# EAGLE design clock (EAGLE 5.11)
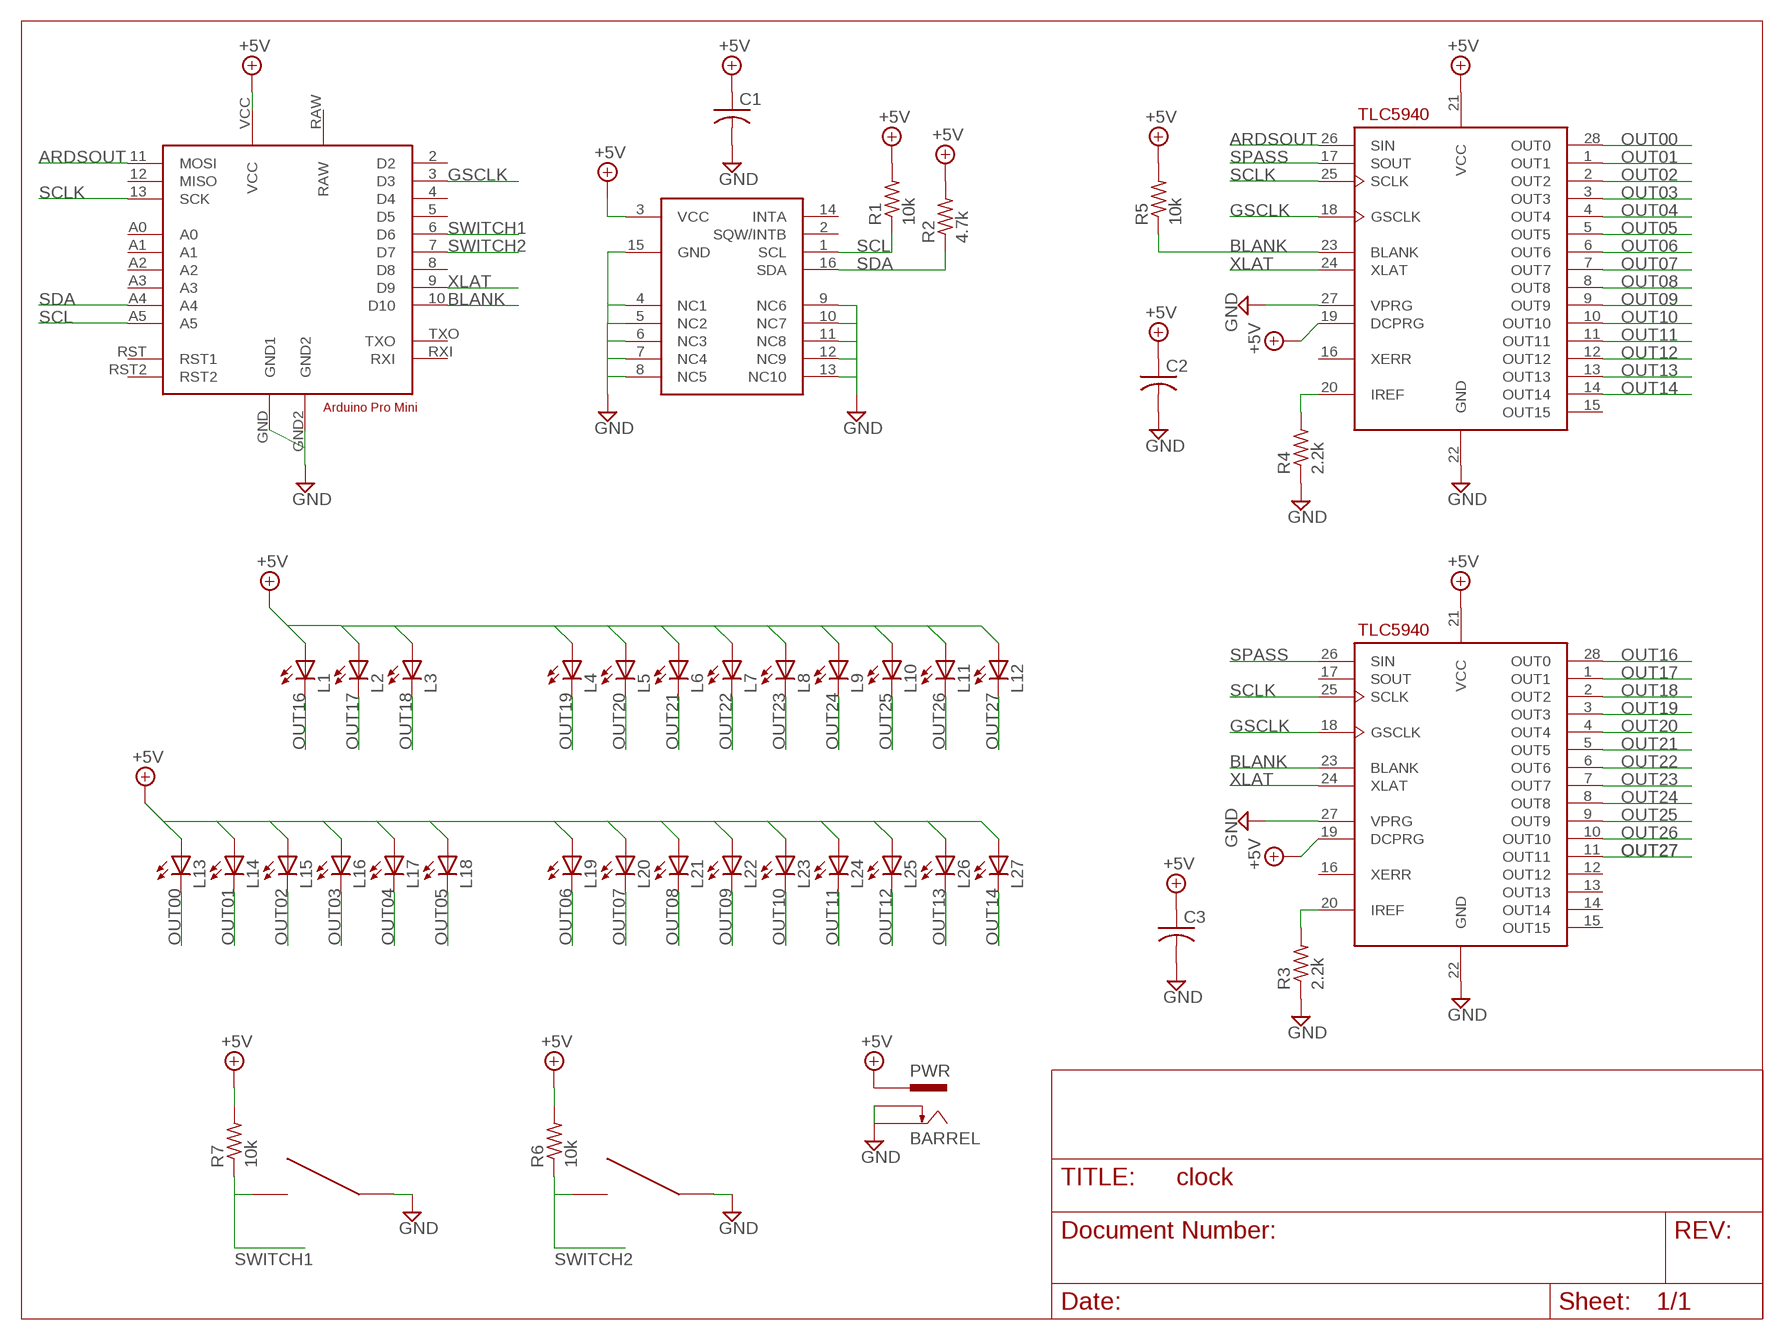
[diagram p0: schematic, sheet 1]

## Parts
C1  C-US025-024X044  [C025-024X044]
C2  C-US025-024X044  [C025-024X044]
C3  C-US025-024X044  [C025-024X044]
L1  LEDKA-3528ASYC  [KA-3528ASYC]
L2  LEDKA-3528ASYC  [KA-3528ASYC]
L3  LEDKA-3528ASYC  [KA-3528ASYC]
L4  LEDKA-3528ASYC  [KA-3528ASYC]
L5  LEDKA-3528ASYC  [KA-3528ASYC]
L6  LEDKA-3528ASYC  [KA-3528ASYC]
L7  LEDKA-3528ASYC  [KA-3528ASYC]
L8  LEDKA-3528ASYC  [KA-3528ASYC]
L9  LEDKA-3528ASYC  [KA-3528ASYC]
L10  LEDKA-3528ASYC  [KA-3528ASYC]
L11  LEDKA-3528ASYC  [KA-3528ASYC]
L12  LEDKA-3528ASYC  [KA-3528ASYC]
L13  LEDKA-3528ASYC  [KA-3528ASYC]
L14  LEDKA-3528ASYC  [KA-3528ASYC]
L15  LEDKA-3528ASYC  [KA-3528ASYC]
L16  LEDKA-3528ASYC  [KA-3528ASYC]
L17  LEDKA-3528ASYC  [KA-3528ASYC]
L18  LEDKA-3528ASYC  [KA-3528ASYC]
L19  LEDKA-3528ASYC  [KA-3528ASYC]
L20  LEDKA-3528ASYC  [KA-3528ASYC]
L21  LEDKA-3528ASYC  [KA-3528ASYC]
L22  LEDKA-3528ASYC  [KA-3528ASYC]
L23  LEDKA-3528ASYC  [KA-3528ASYC]
L24  LEDKA-3528ASYC  [KA-3528ASYC]
L25  LEDKA-3528ASYC  [KA-3528ASYC]
L26  LEDKA-3528ASYC  [KA-3528ASYC]
L27  LEDKA-3528ASYC  [KA-3528ASYC]
PWR  BARREL  [BARREL]
R1  10k  R-US_R1206  [R1206]
R2  4.7k  R-US_R1206  [R1206]
R3  2.2k  R-US_R1206  [R1206]
R4  2.2k  R-US_R1206  [R1206]
R5  10k  R-US_R1206  [R1206]
R6  10k  R-US_R1206  [R1206]
R7  10k  R-US_R1206  [R1206]
SW1  SPST-MICRO  [MICROSWITCH]
SW2  SPST-MICRO  [MICROSWITCH]
U1  TLC5940NT  [DIL28-4]
U2  TLC5940NT  [DIL28-4]
U3  DS1337C  [SO-16DW]
U$4  ARDUINO_MINI_PRO  [ARD_MINI_PRO]

## Nets
+5V: C1.1 C2.1 C3.1 L1.A L2.A L3.A L4.A L5.A L6.A L7.A L8.A L9.A L10.A L11.A L12.A L13.A L14.A L15.A L16.A L17.A L18.A L19.A L20.A L21.A L22.A L23.A L24.A L25.A L26.A L27.A PWR.1 R1.2 R2.2 R5.2 R6.2 R7.2 U1.19(DCPRG) U1.21(VCC) U2.19(DCPRG) U2.21(VCC) U3.3(VCC) U$4.VCC
ARDSOUT: U2.26(SIN) U$4.11(MOSI)
BLANK: R5.1 U1.23(BLANK) U2.23(BLANK) U$4.10(D10)
GND: C1.2 C2.2 C3.2 PWR.2 PWR.3 R3.1 R4.1 SW1.PIN2 SW2.PIN2 U1.22(GND) U1.27(VPRG) U2.22(GND) U2.27(VPRG) U3.4(NC1) U3.5(NC2) U3.6(NC3) U3.7(NC4) U3.8(NC5) U3.9(NC6) U3.10(NC7) U3.11(NC8) U3.12(NC9) U3.13(NC10) U3.15(GND) U$4.GND2 U$4.GND(GND1)
GSCLK: U1.18(GSCLK) U2.18(GSCLK) U$4.3(D3)
N$3: R3.2 U1.20(IREF)
N$4: R4.2 U2.20(IREF)
OUT00: L13.C U2.28(OUT0)
OUT01: L14.C U2.1(OUT1)
OUT02: L15.C U2.2(OUT2)
OUT03: L16.C U2.3(OUT3)
OUT04: L17.C U2.4(OUT4)
OUT05: L18.C U2.5(OUT5)
OUT06: L19.C U2.6(OUT6)
OUT07: L20.C U2.7(OUT7)
OUT08: L21.C U2.8(OUT8)
OUT09: L22.C U2.9(OUT9)
OUT10: L23.C U2.10(OUT10)
OUT11: L24.C U2.11(OUT11)
OUT12: L25.C U2.12(OUT12)
OUT13: L26.C U2.13(OUT13)
OUT14: L27.C U2.14(OUT14)
OUT16: L1.C U1.28(OUT0)
OUT17: L2.C U1.1(OUT1)
OUT18: L3.C U1.2(OUT2)
OUT19: L4.C U1.3(OUT3)
OUT20: L5.C U1.4(OUT4)
OUT21: L6.C U1.5(OUT5)
OUT22: L7.C U1.6(OUT6)
OUT23: L8.C U1.7(OUT7)
OUT24: L9.C U1.8(OUT8)
OUT25: L10.C U1.9(OUT9)
OUT26: L11.C U1.10(OUT10)
OUT27: L12.C U1.11(OUT11)
SCL: R1.1 U3.1(SCL) U$4.A5
SCLK: U1.25(SCLK) U2.25(SCLK) U$4.13(SCK)
SDA: R2.1 U3.16(SDA) U$4.A4
SPASS: U1.26(SIN) U2.17(SOUT)
SWITCH1: R7.1 SW1.PIN1 U$4.6(D6)
SWITCH2: R6.1 SW2.PIN1 U$4.7(D7)
XLAT: U1.24(XLAT) U2.24(XLAT) U$4.9(D9)
Unconnected: U1.12(OUT12) U1.13(OUT13) U1.14(OUT14) U1.15(OUT15) U1.16(XERR) U1.17(SOUT) U2.15(OUT15) U2.16(XERR) U3.2(SQW/INTB) U3.14(INTA) U$4.2(D2) U$4.4(D4) U$4.5(D5) U$4.8(D8) U$4.12(MISO) U$4.A0 U$4.A1 U$4.A2 U$4.A3 U$4.RAW U$4.RST2 U$4.RST(RST1) U$4.RXI U$4.TXO

## Library data of the parts
C1-C3 = rcl:C-US: CAPACITOR, American symbol
L1-L27 = led:LED: LED OSRAM: - CHIPLED LG R971, LG N971, LY N971, LG Q971, LY Q971, LO R971, LY R971 LH N974, LH R974 LS Q976, LO Q976, LY Q976 LO Q996 - Hyper CHIPLED LW Q18S LB Q993, LB Q99A, LB R99A - SideLED LS A670, LO A670, LY A670, LG A670, LP A670 LB A673, LV A673, LT A673, LW A673 LH A674 LY A675 LS A676, LA A676, LO A676, LY A676, LW A676 LS A679, LY A679, LG A679 - Hyper Micro SIDELED® LS Y876, LA Y876, LO Y876, LY Y876 LT Y87S - SmartLED LW L88C, LW L88S LB L89C, LB L89S, LG L890 LS L89K, LO L89K, LY L89K LS L896, LA L896, LO L896, LY L896 - TOPLED LS T670, LO T670, LY T670, LG T670, LP T670 LSG T670, LSP T670, LSY T670, LOP T670, LYG T670 LG T671, LOG T671, LSG T671 LB T673, LV T673, LT T673, LW T673 LH T674 LS T676, LA T676, LO T676, LY T676, LB T676, LH T676, LSB T676, LW T676 LB T67C, LV T67C, LT T67C, LS T67K, LO T67K, LY T67K, LW E67C LS E67B, LA E67B, LO E67B, LY E67B, LB E67C, LV E67C, LT E67C LW T67C LS T679, LY T679, LG T679 LS T770, LO T770, LY T770, LG T770, LP T770 LB T773, LV T773, LT T773, LW T773 LH T774 LS E675, LA E675, LY E675, LS T675 LS T776, LA T776, LO T776, LY T776, LB T776 LHGB T686 LT T68C, LB T68C - Hyper Mini TOPLED® LB M676 - Mini TOPLED Santana® LG M470 LS M47K, LO M47K, LY M47K Source: http://www.osram.convergy.de LUXEON: - LUMILED® LXK2-PW12-R00, LXK2-PW12-S00, LXK2-PW14-U00, LXK2-PW14-V00 LXK2-PM12-R00, LXK2-PM12-S00, LXK2-PM14-U00 LXK2-PE12-Q00, LXK2-PE12-R00, LXK2-PE12-S00, LXK2-PE14-T00, LXK2-PE14-U00 LXK2-PB12-K00, LXK2-PB12-L00, LXK2-PB12-M00, LXK2-PB14-N00, LXK2-PB14-P00, LXK2-PB14-Q00 LXK2-PR12-L00, LXK2-PR12-M00, LXK2-PR14-Q00, LXK2-PR14-R00 LXK2-PD12-Q00, LXK2-PD12-R00, LXK2-PD12-S00 LXK2-PH12-R00, LXK2-PH12-S00 LXK2-PL12-P00, LXK2-PL12-Q00, LXK2-PL12-R00 Source: www.luxeon.com KINGBRIGHT: KA-3528ASYC Source: www.kingbright.com
PWR = clock:BARREL
R1-R7 = resistor:R-US_: RESISTOR, American symbol
SW1 SW2 = clock:SPST-MICRO
U1 U2 = untitled:TLC5940
U3 = untitled:DS1337
U$4 = untitled:ARDUINO_MINI_PRO

## Board
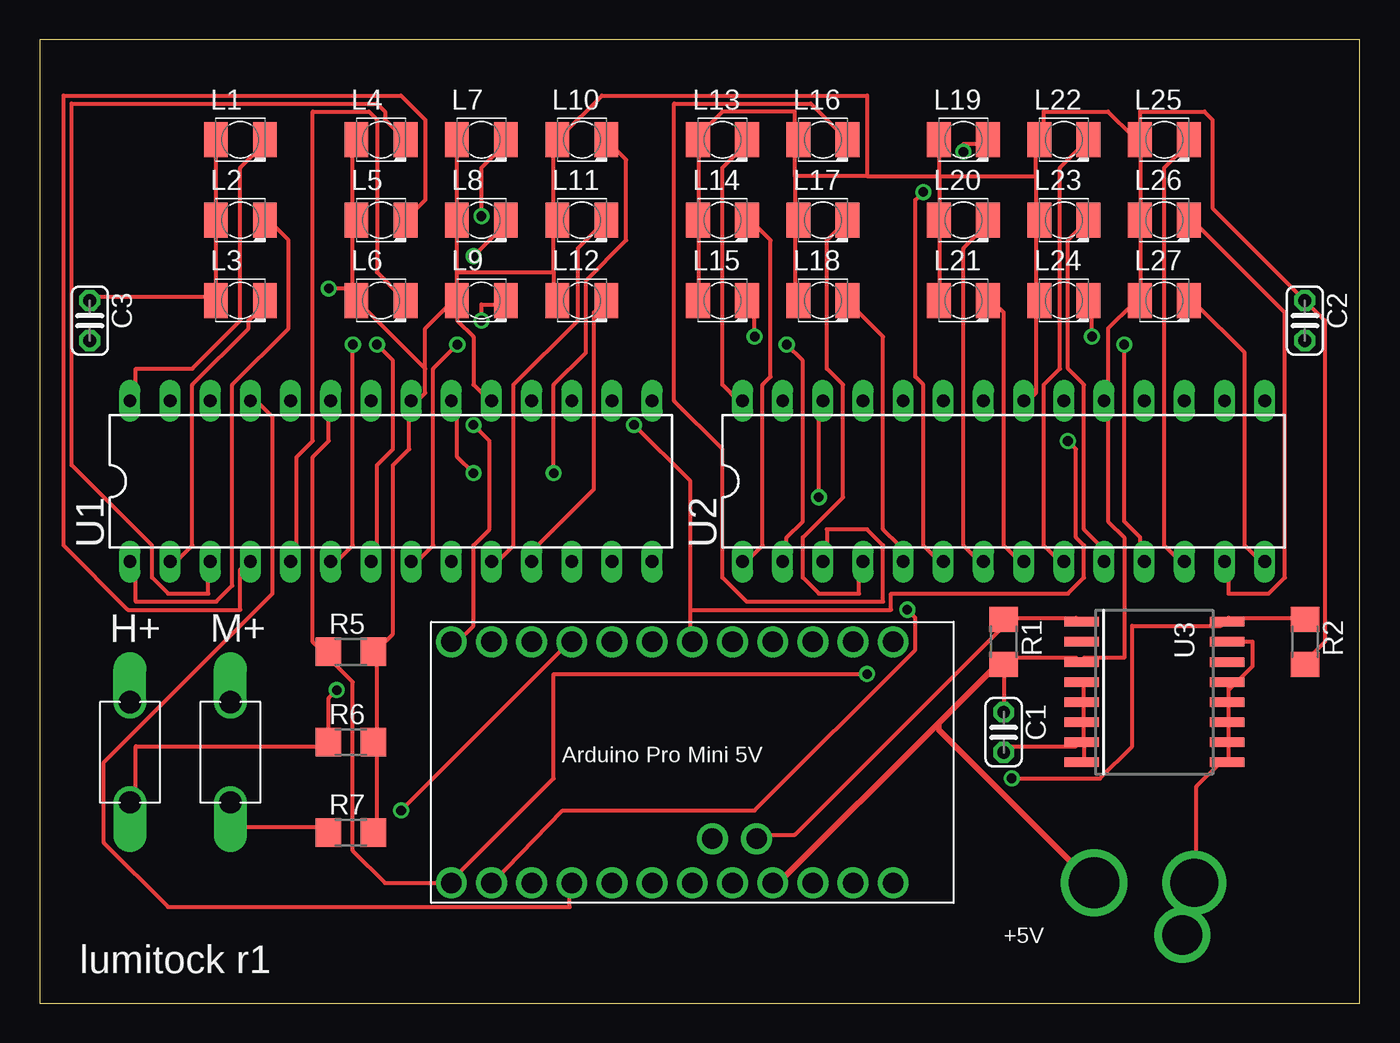
[diagram p1: board, top side]
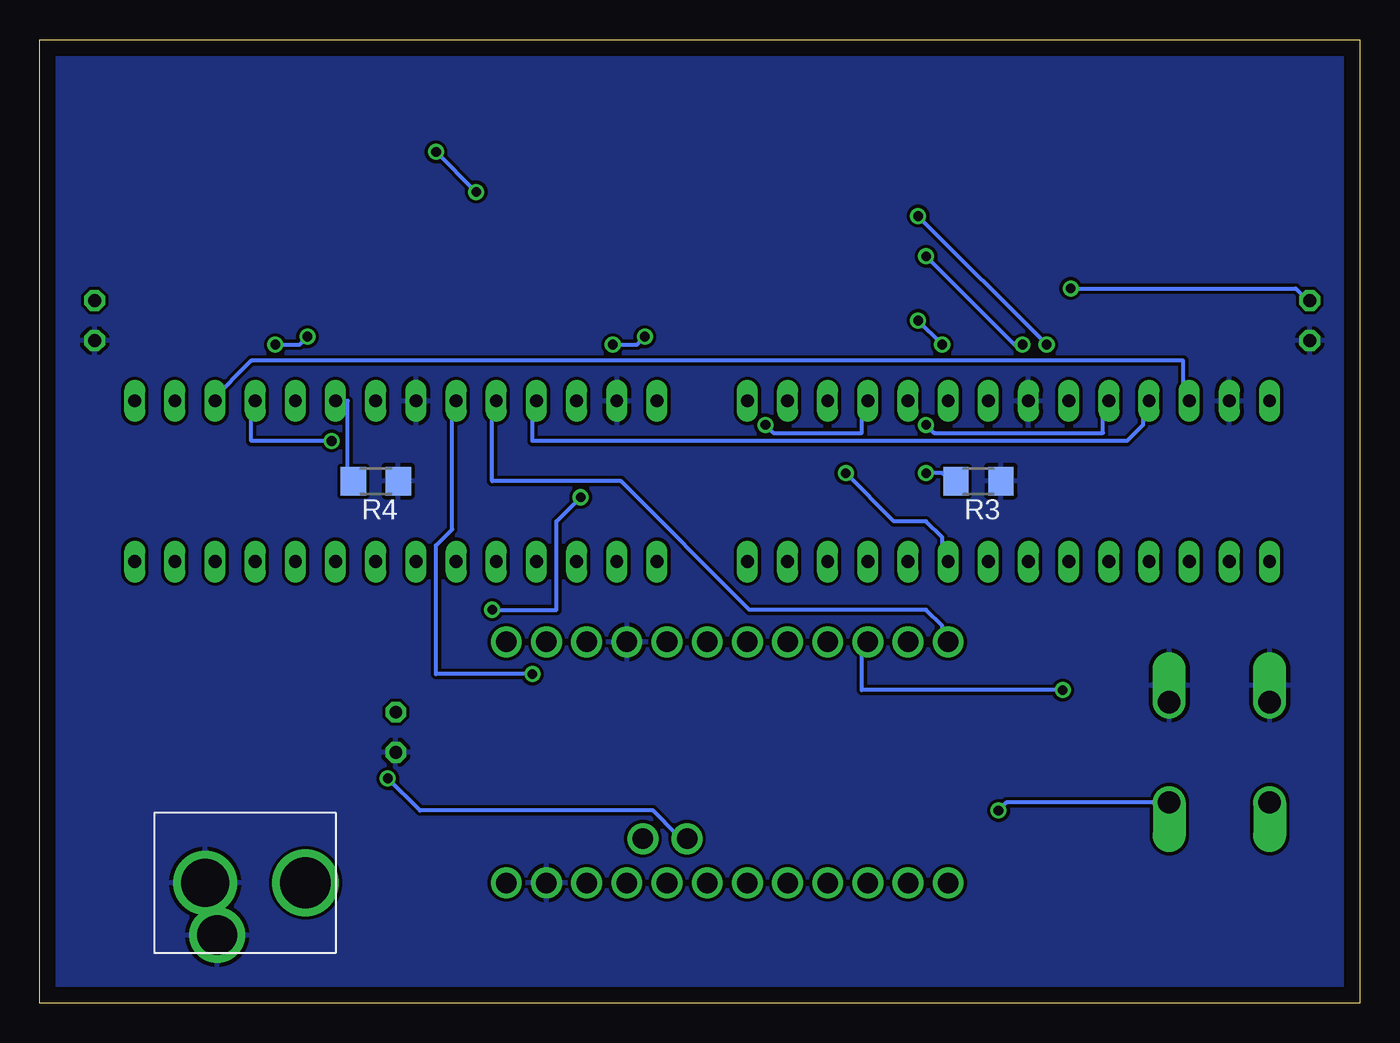
[diagram p2: board, bottom side, seen from below]

Size 83.49 x 60.95 mm. Coordinates in mm from the lower left corner, seen from the top.
Outline: 0,0 83.49,0 83.49,60.95 0,60.95 0,0
Copper layers (1*16): Top 0.035mm / dielectric 1.5mm / Bottom 0.035mm
Design rules "default *": minimum track width 10mil, minimum drill 24mil, track to track 8mil, track to pad 8mil, pad to pad 8mil, via to via 8mil, smd to smd 8mil, copper to edge 40mil, drill to drill 8mil, minimum pad ring 10mil, minimum via ring 8mil, stop-mask expansion 4mil, vias tented up to drill 0mil, thermal gap 10mil

### Footprints (pad centres in the part's own frame; a part is rotated, then mirrored left to right if it is on the bottom)
C025-024X044 = drill 0.813 octagon: 1 -1.27,0; 2 1.27,0
KA-3528ASYC = smd 1.5 x 2.2: A -1.55,0; C 1.55,0
BARREL = drill 3.2 round: 1 0,3.81 | drill 3.029 round: 2 0,-2.54 | drill 2.515 round: 3 3.302,-1.778
R1206 = smd 1.6 x 1.803: 1 -1.422,0; 2 1.422,0
MICROSWITCH = drill 1.4 offset: PIN1 -3.175,0; PIN2 3.175,0
DIL28-4 = drill 0.813 long: 1 -16.51,-5.08; 2 -13.97,-5.08; 3 -11.43,-5.08; 4 -8.89,-5.08; 5 -6.35,-5.08; 6 -3.81,-5.08; 7 -1.27,-5.08; 8 1.27,-5.08; 9 3.81,-5.08; 10 6.35,-5.08; 11 8.89,-5.08; 12 11.43,-5.08; 13 13.97,-5.08; 14 16.51,-5.08; 15 16.51,5.08; 16 13.97,5.08; 17 11.43,5.08; 18 8.89,5.08; 19 6.35,5.08; 20 3.81,5.08; 21 1.27,5.08; 22 -1.27,5.08; 23 -3.81,5.08; 24 -6.35,5.08; 25 -8.89,5.08; 26 -11.43,5.08; 27 -13.97,5.08; 28 -16.51,5.08
SO-16DW = smd 0.6 x 2.2: 1 -4.445,-4.6; 2 -3.175,-4.6; 3 -1.905,-4.6; 4 -0.635,-4.6; 5 0.635,-4.6; 6 1.905,-4.6; 7 3.175,-4.6; 8 4.445,-4.6; 9 4.445,4.6; 10 3.175,4.6; 11 1.905,4.6; 12 0.635,4.6; 13 -0.635,4.6; 14 -1.905,4.6; 15 -3.175,4.6; 16 -4.445,4.6
ARD_MINI_PRO = drill 1.3 round: 2 -7.62,1.27; 3 -7.62,-1.27; 4 -7.62,-3.81; 5 -7.62,-6.35; 6 -7.62,-8.89; 7 -7.62,-11.43; 8 -7.62,-13.97; 9 -7.62,-16.51; 10 7.62,-16.51; 11 7.62,-13.97; 12 7.62,-11.43; 13 7.62,-8.89; A0 7.62,-6.35; A1 7.62,-3.81; A2 7.62,-1.27; A3 7.62,1.27; A4 4.826,0; A5 4.826,2.794; GND -7.62,3.81; GND2 7.62,8.89; RAW 7.62,11.43; RST -7.62,6.35; RST2 7.62,6.35; RXI -7.62,8.89; TXO -7.62,11.43; VCC 7.62,3.81

### Placement (x,y rotation side)
C1  60.96,17.14 270 top
C2  80.01,43.18 270 top
C3  3.17,43.18 270 top
L1  12.7,54.61 0 top
L2  12.7,49.53 0 top
L3  12.7,44.45 0 top
L4  21.59,54.61 0 top
L5  21.59,49.53 0 top
L6  21.59,44.45 0 top
L7  27.94,54.61 0 top
L8  27.94,49.53 0 top
L9  27.94,44.45 0 top
L10  34.29,54.61 0 top
L11  34.29,49.53 0 top
L12  34.29,44.45 0 top
L13  43.18,54.61 0 top
L14  43.18,49.53 0 top
L15  43.18,44.45 0 top
L16  49.53,54.61 0 top
L17  49.53,49.53 0 top
L18  49.53,44.45 0 top
L19  58.42,54.61 0 top
L20  58.42,49.53 0 top
L21  58.42,44.45 0 top
L22  64.77,54.61 0 top
L23  64.77,49.53 0 top
L24  64.77,44.45 0 top
L25  71.12,54.61 0 top
L26  71.12,49.53 0 top
L27  71.12,44.45 0 top
PWR  70.48,7.62 270 bottom
R1  60.96,22.86 270 top
R2  80.01,22.86 270 top
R3  24.13,33.02 180 bottom
R4  62.23,33.02 180 bottom
R5  19.68,22.23 0 top
R6  19.68,16.51 0 top
R7  19.68,10.79 0 top
SW1  12.06,15.88 90 top
SW2  5.71,15.88 90 top
U1  22.23,33.02 0 top
U2  60.96,33.02 0 top
U3  70.48,19.68 270 top
U$4  42.55,15.24 270 top

### Tracks (layer width: path | path; a pad name or v marks a point on that pad's centre or on a via)
+5V  (via drill 0.61)
  Top 0.254: L1.A 11.18,54.36 11.18,49.78 L2.A 11.18,49.28 11.18,44.7 L3.A 10.67,44.7 3.56,44.7 C3.1 | R7.2 21.34,11.18 21.34,16.26 R6.2 21.34,16.76 21.34,21.84 R5.2 21.34,22.35 22.35,23.37 22.35,34.04 23.37,35.05 23.37,38.1 U1.21 23.88,38.1 24.38,38.61 24.38,40.13 | 32.51,46.23 32.51,49.28 L11.A 32.51,49.78 32.51,54.36 L10.A 33.02,54.86 35.56,57.4 52.32,57.4 52.32,52.32 | 32.51,46.23 32.51,44.7 L12.A | 19.81,45.21 19.81,49.28 L5.A 19.81,49.78 19.81,54.36 L4.A | 19.81,45.21 19.81,44.7 L6.A | 26.42,46.23 26.42,49.28 L8.A 26.42,49.78 26.42,54.36 L7.A | 26.42,46.23 26.42,44.7 L9.A | 24.38,40.13 24.38,42.67 25.91,44.2 L9.A | U1.19 28.45,38.1 27.43,39.12 27.43,42.16 26.42,43.18 26.42,44.2 L9.A | 24.38,40.13 20.32,44.2 L6.A | 26.42,46.23 32.51,46.23 | 19.81,45.21 v18.29,45.21 | L6.A 19.81,45.21 | C1.1 R1.2 60.96,21.84 65.53,21.84 U3.3 66.04,21.84 68.58,21.84 68.58,29.46 67.56,30.48 67.56,38.1 | 46.74,7.62 U$4.VCC | 56.9,17.78 56.9,17.27 | 66.55,7.62 PWR.1 | R2.2 80.26,21.84 81.28,22.86 81.28,43.18 C2.1 74.17,50.29 74.17,55.88 73.66,56.39 69.6,56.39 69.6,54.86 L25.A | L25.A 69.6,54.36 69.6,49.78 L26.A 69.6,49.28 69.6,44.7 L27.A 69.09,44.2 67.56,42.67 67.56,38.1 | L15.A 41.66,44.7 41.66,49.28 L14.A 41.66,49.78 41.66,54.36 L13.A 41.66,54.86 43.18,56.39 47.75,56.39 47.75,54.86 L16.A 47.75,54.36 47.75,52.32 | L18.A 47.75,44.7 47.75,49.28 L17.A 47.75,49.78 47.75,52.32 | L21.A 56.9,44.7 56.9,49.28 L20.A 56.9,49.78 56.9,52.32 | 56.9,52.32 56.9,54.36 L19.A | 62.99,52.32 62.99,49.78 L23.A 62.99,49.28 62.99,44.7 L24.A 62.99,44.2 62.99,38.61 62.48,38.1 U2.21 | 62.99,52.32 62.99,54.36 L22.A 63.5,54.86 63.5,56.39 67.56,56.39 69.09,54.86 L25.A
  Top 0.254: 56.9,52.32 62.99,52.32 | 52.32,52.32 56.9,52.32 | 52.32,52.32 47.75,52.32 | 67.56,38.1 U2.19
  Top 0.406: 60.96,21.84 56.9,17.78 46.74,7.62 | 56.9,17.27 66.55,7.62
  Bottom 0.254: v18.29,45.21 4.06,45.21 3.56,44.7 C3.1
ARDSOUT  (via drill 0.61)
  Top 0.254: v49.28,32 49.28,38.1 U2.26 | v54.86,24.89 55.37,24.38 55.37,22.35 45.21,12.19 33.08,12.19 28.64,7.62
  Top 0.406: U$4.11 28.64,7.62
  Bottom 0.254: v49.28,32 50.8,30.48 50.8,24.89 v54.86,24.89
BLANK  (via drill 0.61)
  Top 0.254: U1.23 18.29,38.1 18.29,35.56 17.27,34.54 17.27,22.86 17.78,22.35 R5.1 18.29,21.84 19.81,20.32 19.81,9.65 21.84,7.62 U$4.10 26.42,7.62 26.42,8.13 32.51,14.22 32.51,20.83 v52.32,20.83
  Bottom 0.254: v52.32,20.83 58.42,20.83 58.42,28.96 57.4,29.97 57.4,38.1 U2.23
GND
  Top 0.254: 75.18,17.78 75.18,18.8 U3.12 75.18,19.3 75.18,19.81 | 75.18,19.81 75.18,20.32 U3.13 | 75.18,19.81 76.71,21.34 76.71,22.86 U3.15 | 75.18,17.78 75.18,16.76 U3.10 75.18,16.26 75.18,15.24 U3.9 74.68,15.24 73.15,13.72 73.15,7.62 PWR.2 | 75.18,17.78 U3.11 | U3.8 66.04,15.24 66.04,16.26 U3.7 | 66.04,17.78 66.04,18.8 U3.5 66.04,19.3 66.04,20.32 U3.4 | 66.04,17.78 66.04,16.76 U3.7 | 66.04,17.78 U3.6 | U3.7 65.53,16.26 60.96,16.26 C1.2
  pour Bottom: 0,60.96 83.19,60.96 83.19,0 0,0
GSCLK  (via drill 0.61)
  Top 0.254: v37.59,36.58 41.15,33.02 41.15,24.89 | 41.15,24.89 41.15,22.86 U$4.3 | v65.02,35.56 65.53,35.05 65.53,29.46 66.04,28.96 66.04,26.92 65.02,25.91 53.85,25.91 53.85,24.89 41.15,24.89
  Bottom 0.254: v37.59,36.58 37.08,36.07 31.5,36.07 31.5,38.1 U1.18 | v65.02,35.56 70.1,35.56 70.1,38.1 U2.18
N$3  (via drill 0.61)
  Top 0.254: v27.43,33.53 26.42,34.54 26.42,38.1 U1.20
  Bottom 0.254: v27.43,33.53 26.42,33.53 25.91,33.02 R3.2
N$4
  Bottom 0.254: R4.2 64.01,33.02 64.01,38.1 U2.20
OUT00
  Top 0.254: L13.C 44.7,54.36 43.18,52.83 43.18,39.12 44.2,38.1 U2.28
OUT01
  Top 0.254: L14.C 45.21,49.28 46.23,48.26 46.23,39.62 45.72,39.12 45.72,28.96 44.7,27.94 U2.1
OUT02  (via drill 0.61)
  Top 0.254: v45.21,42.16 45.21,44.2 L15.C | v47.24,41.66 48.26,40.64 48.26,30.48 47.24,29.46 47.24,27.94 U2.2
  Bottom 0.254: v45.21,42.16 45.72,41.66 v47.24,41.66
OUT03
  Top 0.254: L16.C 50.8,54.86 48.77,56.9 40.13,56.9 40.13,38.1 43.18,35.05 43.18,26.92 44.7,25.4 53.34,25.4 53.34,28.96 52.32,29.97 49.78,29.97 49.78,27.94 U2.3
OUT04
  Top 0.254: L17.C 50.8,49.28 49.78,48.26 49.78,40.13 50.8,39.12 50.8,32 48.26,29.46 48.26,26.92 49.28,25.91 51.82,25.91 51.82,27.94 U2.4
OUT05
  Top 0.254: L18.C 51.31,44.2 53.34,42.16 53.34,29.97 54.36,28.96 54.36,27.94 U2.5
OUT06  (via drill 0.61)
  Top 0.254: v58.42,53.85 58.42,54.36 59.94,54.36 L19.C | v55.88,51.31 55.37,50.8 55.37,39.62 55.88,39.12 55.88,28.96 56.9,27.94 U2.6
  Bottom 0.254: v55.88,51.31 v58.42,53.85
OUT07
  Top 0.254: L20.C 59.94,49.28 58.42,47.75 58.42,28.96 59.44,27.94 U2.7
OUT08
  Top 0.254: L21.C 60.45,44.2 60.96,43.69 60.96,28.96 61.98,27.94 U2.8
OUT09
  Top 0.254: L22.C 66.04,54.36 64.52,52.83 64.52,40.13 63.5,39.12 63.5,28.96 64.52,27.94 U2.9
OUT10
  Top 0.254: L23.C 66.04,49.28 65.02,48.26 65.02,40.13 66.04,39.12 66.04,29.97 67.06,28.96 67.06,27.94 U2.10
OUT11  (via drill 0.61)
  Top 0.254: v66.55,42.16 66.55,44.2 L24.C | v68.58,41.66 68.58,30.48 69.6,29.46 69.6,27.94 U2.11
  Bottom 0.254: v66.55,42.16 67.06,41.66 v68.58,41.66
OUT12
  Top 0.254: L25.C 72.64,54.36 71.12,52.83 71.12,28.96 72.14,27.94 U2.12
OUT13
  Top 0.254: L26.C 73.15,49.28 78.74,43.69 78.74,26.92 77.72,25.91 75.18,25.91 75.18,27.94 U2.13
OUT14
  Top 0.254: L27.C 73.15,44.2 76.2,41.15 76.2,28.96 77.22,27.94 U2.14
OUT16
  Top 0.254: L1.C 14.22,54.36 12.7,52.83 12.7,43.18 9.65,40.13 6.1,40.13 6.1,38.1 U1.28
OUT17
  Top 0.254: L2.C 14.73,49.28 15.75,48.26 15.75,42.67 12.19,39.12 12.19,26.42 11.18,25.4 6.1,25.4 6.1,27.94 U1.1
OUT18
  Top 0.254: L3.C 14.22,44.2 13.21,43.18 13.21,42.67 9.65,39.12 9.65,28.96 8.64,27.94 U1.2
OUT19
  Top 0.254: L4.C 22.86,54.86 21.84,55.88 21.84,56.39 21.34,56.9 2.03,56.9 2.03,34.04 7.11,28.96 7.11,26.92 8.13,25.91 10.67,25.91 10.67,27.94 U1.3
OUT20
  Top 0.254: L5.C 23.37,49.78 24.38,50.8 24.38,55.88 22.86,57.4 1.52,57.4 1.52,28.96 5.59,24.89 12.7,24.89 12.7,27.43 13.21,27.94 U1.4
OUT21
  Top 0.254: L6.C 22.86,44.7 21.34,46.23 21.34,55.88 20.83,56.39 17.27,56.39 17.27,35.56 16.26,34.54 16.26,27.94 U1.5
OUT22  (via drill 0.61)
  Top 0.254: v27.94,49.78 27.94,52.83 29.46,54.36 L7.C | v19.81,41.66 19.81,28.96 18.8,27.94 U1.6
  Bottom 0.254: v19.81,41.66 v27.94,49.78
OUT23  (via drill 0.61)
  Top 0.254: v27.43,47.24 29.46,49.28 L8.C | v21.34,41.66 22.35,40.64 22.35,35.05 21.34,34.04 21.34,27.94 U1.7
  Bottom 0.254: v27.43,47.24 21.84,41.66 v21.34,41.66
OUT24  (via drill 0.61)
  Top 0.254: v27.94,43.18 27.94,44.2 29.46,44.2 L9.C | v26.42,41.66 24.89,40.13 24.89,28.96 23.88,27.94 U1.8
  Bottom 0.254: v26.42,41.66 v27.94,43.18
OUT25  (via drill 0.61)
  Top 0.254: v32.51,33.53 32.51,39.12 34.54,41.15 34.54,45.72 37.08,48.26 37.08,53.34 36.07,54.36 L10.C
  Bottom 0.254: v32.51,33.53 29.46,30.48 27.43,30.48 26.42,29.46 26.42,27.94 U1.9
OUT26
  Top 0.254: L11.C 35.56,49.28 34.04,47.75 34.04,43.18 29.97,39.12 29.97,28.96 28.96,27.94 U1.10
OUT27
  Top 0.254: L12.C 35.56,44.2 35.05,43.69 35.05,32.51 31.5,28.96 31.5,27.94 U1.11
SCL
  Top 0.254: U3.1 65.53,24.38 60.96,24.38 R1.1 60.96,23.88 47.75,10.67 45.72,10.67 U$4.A5
SCLK
  Top 0.254: U1.25 13.72,38.1 14.73,37.08 14.73,25.91 4.06,15.24 4.06,10.16 8.13,6.1 33.53,6.1 33.53,7.62 U$4.13
  Bottom 0.254: U2.25 52.32,38.1 52.32,35.56 14.73,35.56 13.72,36.58 13.72,38.1 U1.25
SDA  (via drill 0.61)
  Top 0.254: R2.1 79.76,24.38 75.18,24.38 U3.16 74.68,23.88 69.09,23.88 69.09,16.26 67.06,14.22 v61.47,14.22
  Bottom 0.254: v61.47,14.22 59.44,12.19 44.7,12.19 43.18,10.67 42.67,10.67 U$4.A4
SPASS
  Bottom 0.254: U1.26 11.18,38.1 11.18,40.64 70.1,40.64 72.64,38.1 U2.17
SWITCH1  (via drill 0.61)
  Top 0.254: R7.1 17.78,11.18 12.19,11.18 12.19,12.7 SW1.PIN1 | v22.86,12.19 33.53,22.86 U$4.6
  Bottom 0.254: v22.86,12.19 22.35,12.7 SW1.PIN1
SWITCH2  (via drill 0.61)
  Top 0.254: SW2.PIN1 6.1,12.7 6.1,16.26 17.78,16.26 R6.1 18.29,16.76 18.29,19.3 v18.8,19.81
  Bottom 0.254: v18.8,19.81 31.5,19.81 31.5,22.86 U$4.7
XLAT  (via drill 0.61)
  Top 0.254: v27.43,36.58 28.45,35.56 28.45,29.97 27.43,28.96 27.43,23.88 26.42,22.86 U$4.9
  Bottom 0.254: v27.43,36.58 26.92,36.07 16.26,36.07 16.26,38.1 U1.24 | U2.24 54.86,38.1 54.86,33.02 46.74,33.02 38.61,24.89 27.43,24.89 26.42,23.88 26.42,22.86 U$4.9

### Text on the board
tPlace: H+ | M+ | lumitock r1
tNames: Arduino Pro Mini 5V | +5V